# EAGLE design Cap-Touch-Keypad-REG-v1.0 (EAGLE 6.2)
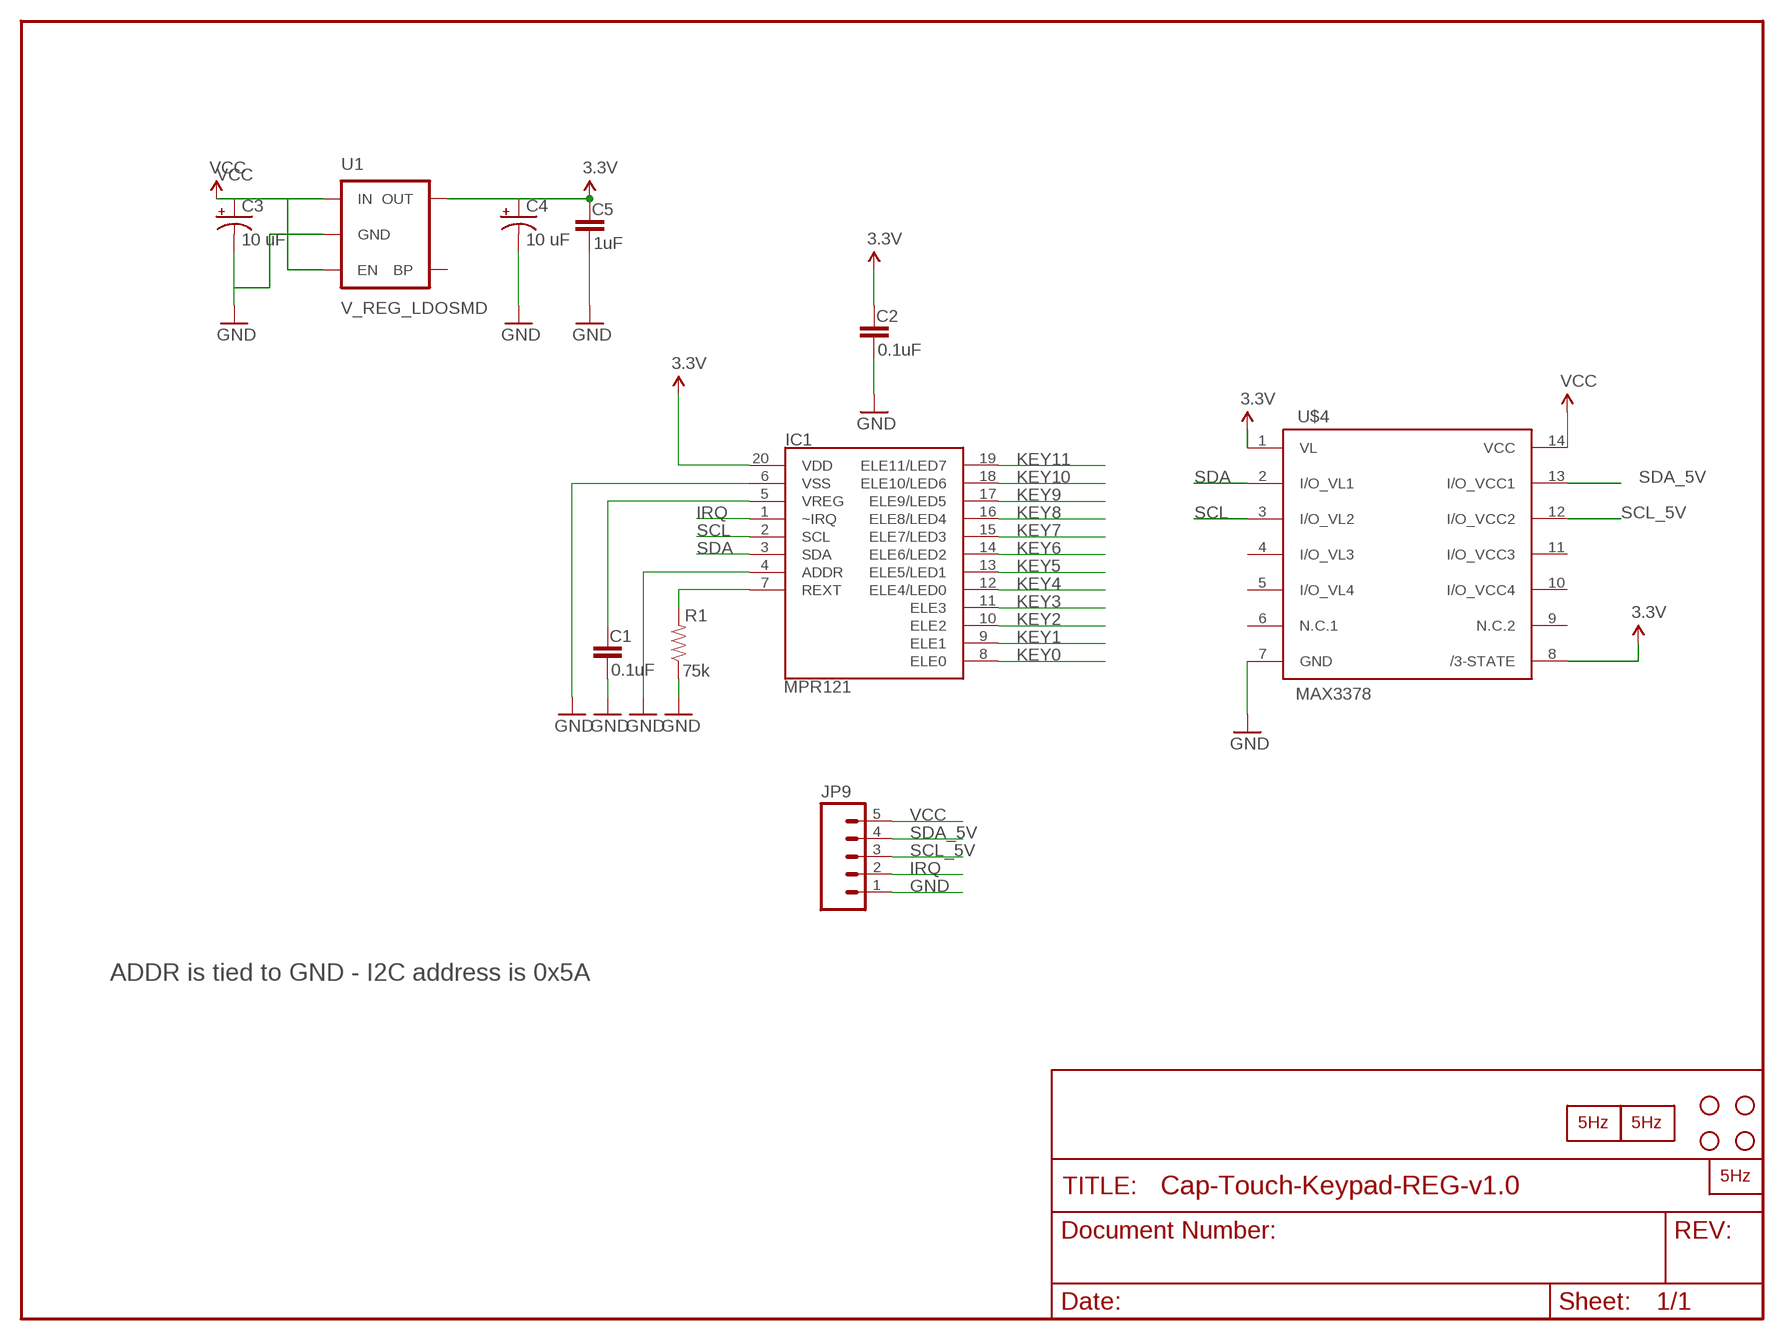
[diagram p0: schematic, sheet 1]

## Parts
C1  0.1uF  CAP0402-CAP  [0402-CAP]
C2  0.1uF  CAP0402-CAP  [0402-CAP]
C3  10 uF  CAP_POL1206  [EIA3216]
C4  10 uF  CAP_POL1206  [EIA3216]
C5  1uF  CAP0402-CAP  [0402-CAP]
IC1  MPR121  MPR121QFN20  [QFN-20-0.4MM]
JP3  STAND-OFF  [STAND-OFF]
JP4  STAND-OFF  [STAND-OFF]
JP7  STAND-OFF  [STAND-OFF]
JP8  STAND-OFF  [STAND-OFF]
JP9  M05PTH  [1X05]
R1  75k  RESISTOR0402-RES  [0402-RES]
U1  V_REG_LDOSMD  [SOT23-5]
U$1  LOGO2_SILKL20MM  [LARGO2_20MM]
U$2  LOGO2_SILKC5MM  [CIRCULO2_5MM]
U$3  LOGO2_SILKC5MM  [CIRCULO2_5MM]
U$4  MAX3378  [TSSOP14]

## Nets
3.3V: C2.1 C4.A(+) C5.1 IC1.20(VDD) U1.5(OUT) U$4.1(VL) U$4.8(/3-STATE)
GND: C1.2 C2.2 C3.C(-) C4.C(-) C5.2 IC1.4(ADDR) IC1.6(VSS) JP9.1 R1.1 U1.2(GND) U$4.7(GND)
IRQ: IC1.1(~IRQ) JP9.2
KEY0: IC1.8(ELE0)
KEY1: IC1.9(ELE1)
KEY2: IC1.10(ELE2)
KEY3: IC1.11(ELE3)
KEY4: IC1.12(ELE4/LED0)
KEY5: IC1.13(ELE5/LED1)
KEY6: IC1.14(ELE6/LED2)
KEY7: IC1.15(ELE7/LED3)
KEY8: IC1.16(ELE8/LED4)
KEY9: IC1.17(ELE9/LED5)
KEY10: IC1.18(ELE10/LED6)
KEY11: IC1.19(ELE11/LED7)
REXT: IC1.7(REXT) R1.2
SCL: IC1.2(SCL) U$4.3(I/O_VL2)
SCL_5V: JP9.3 U$4.12(I/O_VCC2)
SDA: IC1.3(SDA) U$4.2(I/O_VL1)
SDA_5V: JP9.4 U$4.13(I/O_VCC1)
VCC: C3.A(+) JP9.5 U1.1(IN) U1.3(EN) U$4.14(VCC)
VREG: C1.1 IC1.5(VREG)
Unconnected: U1.4(BP) U$4.4(I/O_VL3) U$4.5(I/O_VL4) U$4.6(N.C.1) U$4.9(N.C.2) U$4.10(I/O_VCC4) U$4.11(I/O_VCC3)

## Notes on the sheet
- ADDR is tied to GND - I2C address is 0x5A

## Library data of the parts
C1 C2 C5 = SparkFun:CAP: Capacitor Standard 0603 ceramic capacitor, and 0.1" leaded capacitor.
C3 C4 = SparkFun:CAP_POL: Capacitor Polarized These are standard SMD and PTH capacitors. Normally 10uF, 47uF, and 100uF in electrolytic and tantalum varieties. Always verify the external diameter of the through hole cap, it varies with capacity, voltage, and manufacturer. The EIA devices should be standard.
IC1 = SparkFun:MPR121: MPR121 Capacitive Touch Sensor Controller
JP3 JP4 JP7 JP8 = SparkFun:STAND-OFF: Stand Off This is the mechanical footprint for a #4 phillips button head screw. Use the keepout ring to avoid running the screw head into surrounding components. SKU : PRT-00447
JP9 = SparkFun:M05: Header 5 Standard 5-pin 0.1" header. Use with straight break away headers (SKU : PRT-00116), right angle break away headers (PRT-00553), swiss pins (PRT-00743), machine pins (PRT-00117), and female headers (PRT-00115). Molex polarized connector foot print use with SKU : PRT-08230 with associated crimp pins and housings.
R1 = SparkFun:RESISTOR: Resistor Basic schematic elements and footprints for 0603, 1206, and PTH 1/10th watt (small) resistors.
U1 = SparkFun:V_REG_LDO: Voltage Regulator LDO Standard 150mA LDO voltage regulator in SOT-23 layout. Micrel part MIC5205. BP (by-pass) pin is used to lower output noise with 470pF cap.
U$1-U$3 = LOGO:LOGO2_SILK: PRINCIPAL
U$4 = MAÑE:MAX3378

## Board
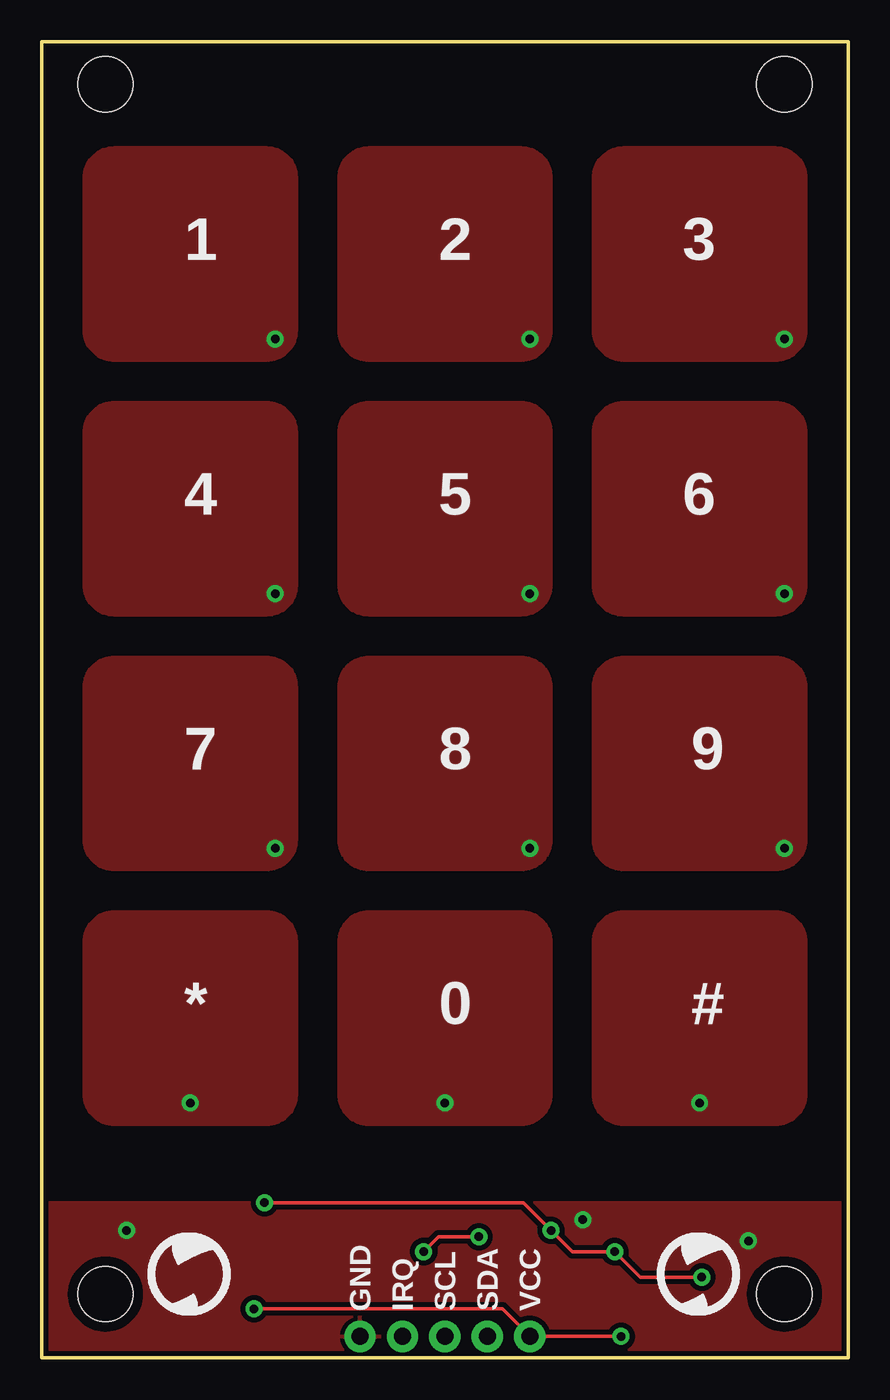
[diagram p1: board, top side]
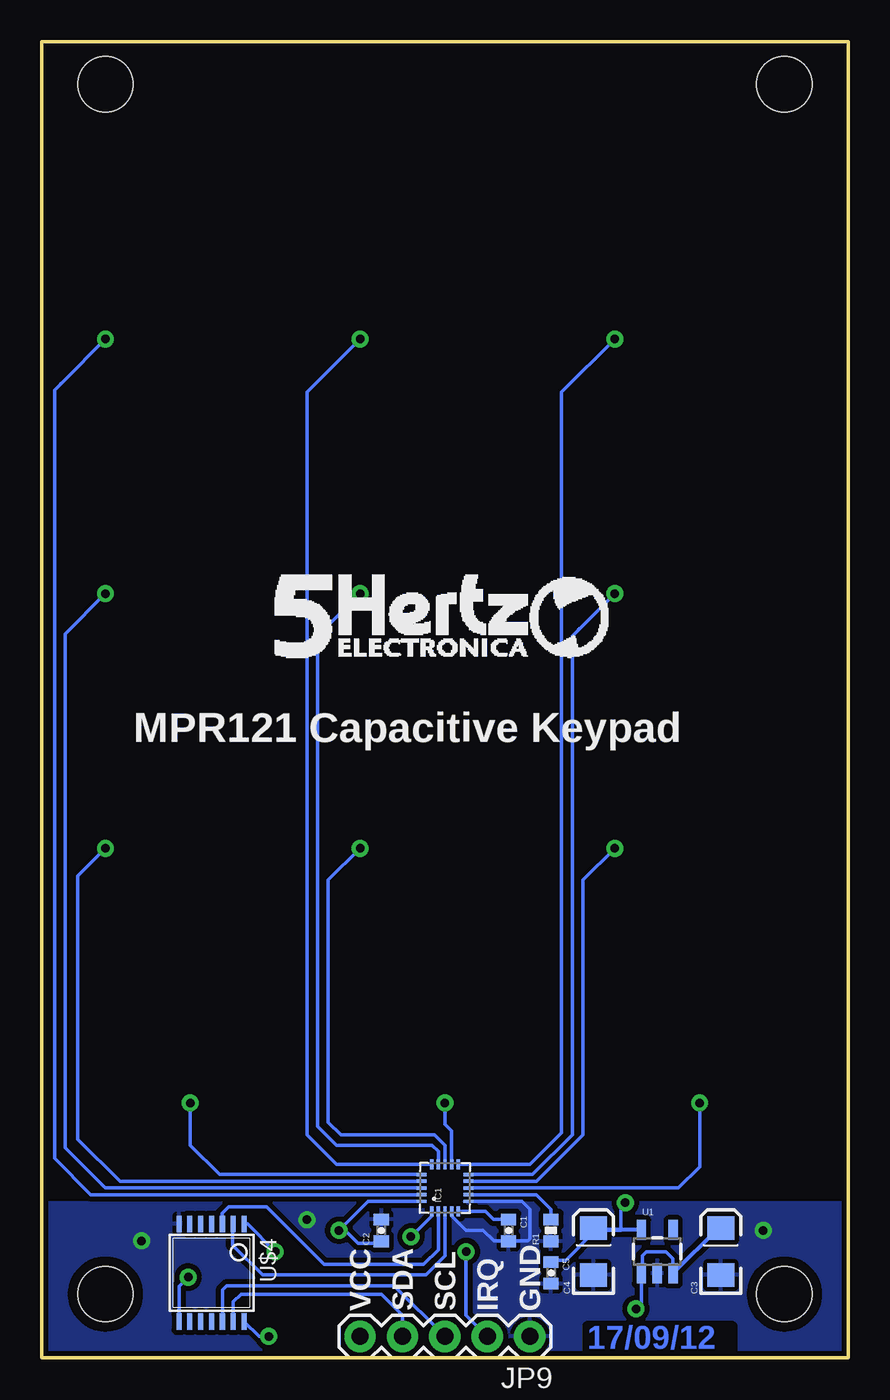
[diagram p2: board, bottom side, seen from below]

Size 48.26 x 78.74 mm. Coordinates in mm from the lower left corner, seen from the top.
Outline: 48.26,0 0,0 0,78.74 48.26,78.74 48.26,0
Copper layers (1*16): Top 0.035mm / dielectric 1.5mm / Bottom 0.035mm
Design rules: minimum track width 8mil, minimum drill 20mil, track to track 8mil, track to pad 8mil, pad to pad 8mil, via to via 8mil, smd to smd 8mil, copper to edge 10mil, drill to drill 8mil, minimum pad ring 12mil, minimum via ring 10mil, stop-mask expansion 4mil, vias tented up to drill 25mil, thermal gap 10mil

### Footprints (pad centres in the part's own frame; a part is rotated, then mirrored left to right if it is on the bottom)
0402-CAP = smd 0.7 x 0.9: 1 -0.65,0; 2 0.65,0
EIA3216 = smd 1.4 x 1.6: A 1.4,0; C -1.4,0
QFN-20-0.4MM = smd 0.6 x 0.2: 1 -1.4,0.8; 2 -1.4,0.4; 3 -1.4,0; 4 -1.4,-0.4; 5 -1.4,-0.8; 11 1.4,-0.8; 12 1.4,-0.4; 13 1.4,0; 14 1.4,0.4; 15 1.4,0.8 | smd 0.2 x 0.6: 6 -0.8,-1.4; 7 -0.4,-1.4; 8 0,-1.4; 9 0.4,-1.4; 10 0.8,-1.4; 16 0.8,1.4; 17 0.4,1.4; 18 0,1.4; 19 -0.4,1.4; 20 -0.8,1.4
STAND-OFF = hole 3.302: 0,0
1X05 = drill 1.016 pad 1.88: 1 0,0; 2 2.54,0; 3 5.08,0; 4 7.62,0; 5 10.16,0
0402-RES = smd 0.7 x 0.9: 1 -0.65,0; 2 0.65,0
SOT23-5 = smd 0.55 x 1.2: 1 -0.95,-1.3; 2 0,-1.3; 3 0.95,-1.3; 4 0.95,1.3; 5 -0.95,1.3
TSSOP14 = smd 0.305 x 0.991: 1 -1.95,-2.918; 2 -1.3,-2.918; 3 -0.65,-2.918; 4 0,-2.918; 5 0.65,-2.918; 6 1.3,-2.918; 7 1.95,-2.918; 8 1.95,2.918; 9 1.3,2.918; 10 0.65,2.918; 11 0,2.918; 12 -0.65,2.918; 13 -1.3,2.918; 14 -1.95,2.918

### Placement (x,y rotation side)
C1  20.32,7.62 270 bottom
C2  27.94,7.62 90 bottom
C3  7.62,6.35 90 bottom
C4  15.24,6.35 90 bottom
C5  17.78,5.08 270 bottom
IC1  24.13,10.16 90 bottom
JP3  44.45,3.81 0 bottom
JP4  3.81,3.81 0 bottom
JP7  44.45,76.2 0 bottom
JP8  3.81,76.2 0 bottom
JP9  19.05,1.27 180 bottom
R1  17.78,7.62 90 bottom
U1  11.43,6.35 0 bottom
U$1  34.29,41.91 0 bottom
U$2  6.35,2.54 0 top
U$3  36.83,2.54 0 top
U$4  38.1,5.08 180 bottom

### Tracks (layer width: path | path; a pad name or v marks a point on that pad's centre or on a via)
3.3V  (via drill 0.51)
  Top 0.203: v39.5,4.83 35.81,4.83 v34.29,6.35 31.75,6.35 v30.48,7.62 28.83,9.27 v13.34,9.27
  Bottom 0.203: C4.A 15.24,7.49 | 15.24,7.49 16.89,5.84 17.4,5.84 | 17.4,5.84 17.67,5.84 C5.1 17.51,5.73 17.4,5.84 | U$4.1 35.94,8 v34.29,6.35 | C2.1 28.05,6.86 29.34,6.86 30.1,7.62 v30.48,7.62 28.74,9.36 IC1.20 | U$4.8 40.05,4.27 v39.5,4.83 | 15.24,7.49 15.11,7.62 13.59,7.62 13.59,9.02 v13.34,9.27
  Bottom 0.254: U1.5 15.14,7.65 C4.A
GND  (via drill 0.51)
  Bottom 0.203: IC1.4 23.73,8.49 22.86,7.62 21.84,7.62 21.21,6.99 20.34,6.99 C1.2 20.3,6.99 19.18,6.99 19.05,7.11 19.05,8.89 19.52,9.36 IC1.6
  other vias: 42.29,6.99 32.38,8.26 5.08,7.62
  pour Top (isolate 0.305): 48.26,0 48.13,9.27 0,9.27 0,0
  pour Bottom (isolate 0.305): 48.26,0 48.26,9.27 0,9.27 0,0
IRQ  (via drill 0.51)
  Top 0.203: v26.16,7.24 23.75,7.24 v22.86,6.35
  Bottom 0.203: IC1.1 24.93,8.47 v26.16,7.24 | v22.86,6.35 22.86,2.54 JP9.2
KEY0  (via drill 0.51)
  Bottom 0.203: IC1.8 10.16,10.16 8.89,11.43 v8.89,15.24
  pour Top (isolate 0.305): 13.44,13.97 arc90 15.24,15.77 15.24,24.87 arc90 13.44,26.67 4.34,26.67 arc90 2.54,24.87 2.54,15.77 arc90 4.34,13.97
KEY1  (via drill 0.51)
  Bottom 0.203: IC1.9 18.65,10.56 15.88,13.34 15.88,28.57 v13.97,30.48
  pour Top (isolate 0.305): 15.24,40.11 arc90 13.44,41.91 4.34,41.91 arc90 2.54,40.11 2.54,31.01 arc90 4.34,29.21 13.44,29.21 arc90 15.24,31.01
KEY2  (via drill 0.51)
  Bottom 0.203: IC1.10 18.89,10.96 16.51,13.34 16.51,43.18 15.88,43.81 | 15.88,43.81 16.13,43.56 | 15.88,43.81 v13.97,45.72
  pour Top (isolate 0.305): 15.24,55.35 arc90 13.44,57.15 4.34,57.15 arc90 2.54,55.35 2.54,46.25 arc90 4.34,44.45 13.44,44.45 arc90 15.24,46.25
KEY3  (via drill 0.51)
  Bottom 0.203: IC1.11 19.05,11.56 17.14,13.46 17.14,57.78 v13.97,60.96
  pour Top (isolate 0.305): 15.24,70.59 arc90 13.44,72.39 4.34,72.39 arc90 2.54,70.59 2.54,61.49 arc90 4.34,59.69 13.44,59.69 arc90 15.24,61.49
KEY4  (via drill 0.51)
  Bottom 0.203: IC1.12 23.73,13.57 24.13,13.97 v24.13,15.24
  pour Top (isolate 0.305): 28.68,13.97 arc90 30.48,15.77 30.48,24.87 arc90 28.68,26.67 19.58,26.67 arc90 17.78,24.87 17.78,15.77 arc90 19.58,13.97
KEY5  (via drill 0.51)
  Bottom 0.203: IC1.13 24.13,12.7 24.77,13.34 30.35,13.34 31.11,14.1 31.11,28.57 v29.21,30.48
  pour Top (isolate 0.305): 30.48,40.11 arc90 28.68,41.91 19.58,41.91 arc90 17.78,40.11 17.78,31.01 arc90 19.58,29.21 28.68,29.21 arc90 30.48,31.01
KEY6  (via drill 0.51)
  Bottom 0.203: IC1.14 24.53,12.34 24.89,12.7 30.61,12.7 31.75,13.84 31.75,43.18 v29.21,45.72
  pour Top (isolate 0.305): 30.48,55.35 arc90 28.68,57.15 19.58,57.15 arc90 17.78,55.35 17.78,46.25 arc90 19.58,44.45 28.68,44.45 arc90 30.48,46.25
KEY7  (via drill 0.51)
  Bottom 0.203: IC1.15 30.61,11.56 32.38,13.34 32.38,57.78 v29.21,60.96
  pour Top (isolate 0.305): 30.48,70.59 arc90 28.68,72.39 19.58,72.39 arc90 17.78,70.59 17.78,61.49 arc90 19.58,59.69 28.68,59.69 arc90 30.48,61.49
KEY8  (via drill 0.51)
  Bottom 0.203: IC1.16 37.63,10.96 39.37,12.7 v39.37,15.24
  pour Top (isolate 0.305): 45.72,24.87 arc90 43.92,26.67 34.82,26.67 arc90 33.02,24.87 33.02,15.77 arc90 34.82,13.97 43.92,13.97 arc90 45.72,15.77
KEY9  (via drill 0.51)
  Bottom 0.203: IC1.17 43.58,10.56 46.1,13.08 46.1,28.83 v44.45,30.48
  pour Top (isolate 0.305): 45.72,40.11 arc90 43.92,41.91 34.82,41.91 arc90 33.02,40.11 33.02,31.01 arc90 34.82,29.21 43.92,29.21 arc90 45.72,31.01
KEY10  (via drill 0.51)
  Bottom 0.203: v44.45,45.72 46.86,43.31 46.86,12.57 44.45,10.16 IC1.18
  pour Top (isolate 0.305): 33.02,46.25 arc90 34.82,44.45 43.92,44.45 arc90 45.72,46.25 45.72,55.35 arc90 43.92,57.15 34.82,57.15 arc90 33.02,55.35
KEY11  (via drill 0.51)
  Bottom 0.203: 46.99,58.42 47.12,58.29 | 46.99,58.42 v44.45,60.96 | 46.99,58.42 47.5,57.91 47.5,11.94 45.32,9.76 IC1.19
  pour Top (isolate 0.305): 34.82,72.39 arc90 33.02,70.59 33.02,61.49 arc90 34.82,59.69 43.92,59.69 arc90 45.72,61.49 45.72,70.59 arc90 43.92,72.39
REXT
  Bottom 0.203: IC1.7 18.65,9.76 17.78,8.89 R1.2
SCL
  Bottom 0.203: IC1.2 24.53,6.46 25.4,5.59 31.37,5.59 34.8,9.02 37.08,9.02 37.47,8.64 37.47,8.01 U$4.3
SCL_5V
  Bottom 0.203: U$4.12 37.45,4.08 37.21,4.32 27.18,4.32 JP9.3
SDA
  Bottom 0.203: IC1.3 24.13,6.1 25.27,4.95 35.05,4.95 36.83,6.73 36.83,7.97 U$4.2
SDA_5V
  Bottom 0.203: JP9.4 26.67,2.54 27.94,3.81 36.32,3.81 36.8,3.33 U$4.13
VCC  (via drill 0.51)
  Top 0.203: v12.7,2.92 27.56,2.92 JP9.5 v34.67,1.27
  Bottom 0.203: U1.3 10.48,5.91 10.92,6.35 12.06,6.35 12.32,6.1 12.32,5.11 U1.1 12.38,3.24 v12.7,2.92 | v34.67,1.27 35.26,1.27 U$4.14
  Bottom 0.254: C3.A 7.78,7.75 U1.3
VREG
  Bottom 0.203: IC1.5 21.72,8.76 21.23,8.27 C1.1

### Text on the board
Bottom: 17/09/12
tPlace: 1 | 2 | 3 | 4 | 5 | 6 | 7 | 8 | 9 | * | 0 | # | GND | IRQ | SCL | SDA | VCC
bPlace: MPR121 Capacitive Keypad | GND | IRQ | SCL | SDA | VCC
Measures: All Dimensions in mil | 3100 | 3000 | 1150 | 1050 | 550 | 400 | 150 | 50 | 0 | 0 | 0 | 0 | 0 | 100 | 150 | 600 | 700 | 750 | 850 | 950 | 1050 | 1150 | 1750 | 1900
Reference: vcc | irq | scl | sda | gnd